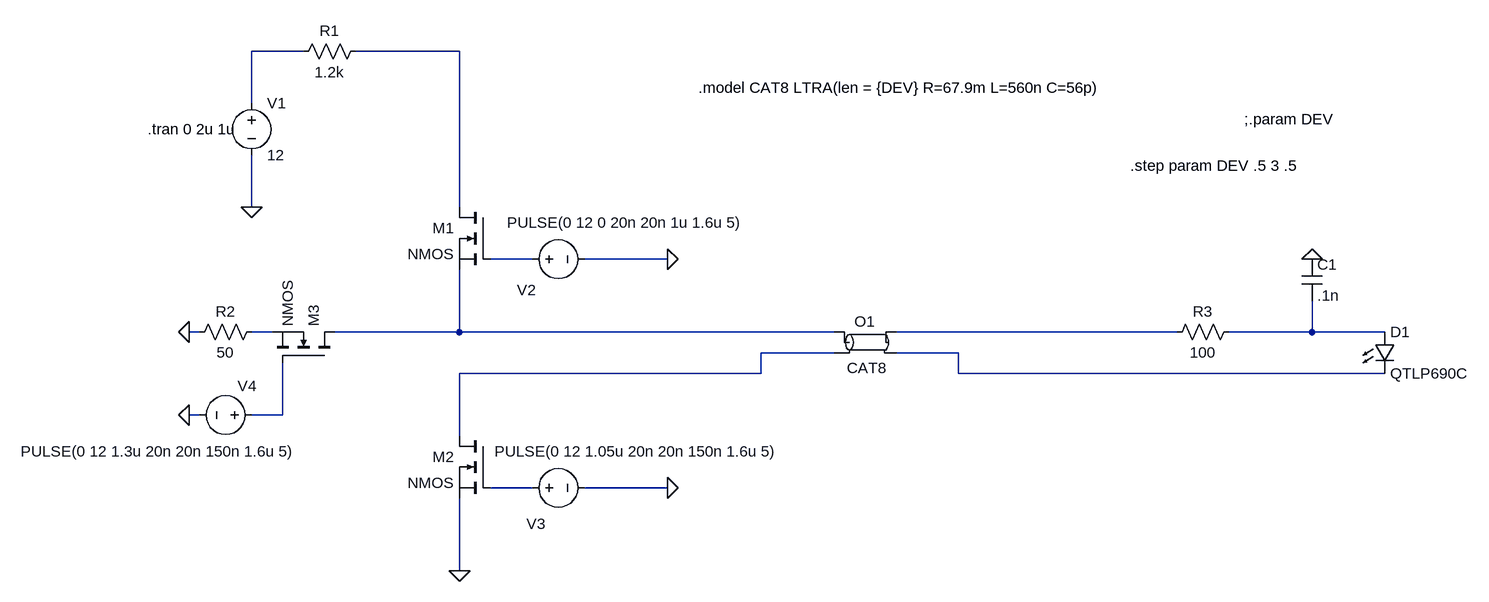
[diagram p0: schematic LEDpulser4_CAT8_NEW.asc]
LEDpulser4_CAT8_NEW.asc, the LTspice schematic file:
Version 4
SHEET 1 1400 680
WIRE -592 -336 -672 -336
WIRE -352 -336 -512 -336
WIRE -672 -256 -672 -336
WIRE -672 -96 -672 -176
WIRE -352 -96 -352 -336
WIRE -240 -16 -304 -16
WIRE -32 -16 -160 -16
WIRE -752 96 -768 96
WIRE -640 96 -672 96
WIRE -352 96 -352 0
WIRE -352 96 -544 96
WIRE 224 96 -352 96
WIRE 752 96 320 96
WIRE 960 96 960 48
WIRE 960 96 832 96
WIRE 1072 96 960 96
WIRE 224 128 112 128
WIRE 416 128 320 128
WIRE 112 160 112 128
WIRE 112 160 -352 160
WIRE 416 160 416 128
WIRE 1072 160 416 160
WIRE -752 224 -768 224
WIRE -624 224 -624 144
WIRE -624 224 -672 224
WIRE -352 256 -352 160
WIRE -240 336 -304 336
WIRE -32 336 -160 336
WIRE -352 464 -352 352
FLAG -32 -16 0
FLAG -672 -96 0
FLAG -32 336 0
FLAG -768 224 0
FLAG -768 96 0
FLAG 960 -16 0
FLAG -352 464 0
SYMBOL voltage -672 -272 R0
WINDOW 123 0 0 Left 0
WINDOW 39 0 0 Left 0
SYMATTR InstName V1
SYMATTR Value 12
SYMBOL voltage -256 -16 R270
WINDOW 0 -63 7 VTop 2
WINDOW 3 72 159 VBottom 2
WINDOW 123 0 0 Left 0
WINDOW 39 0 0 Left 0
SYMATTR InstName V2
SYMATTR Value PULSE(0 12 0 20n 20n 1u 1.6u 5)
SYMBOL nmos -304 -96 M0
SYMATTR InstName M1
SYMBOL res -496 -352 R90
WINDOW 0 0 56 VBottom 2
WINDOW 3 32 56 VTop 2
SYMATTR InstName R1
SYMATTR Value 1.2k
SYMBOL nmos -304 256 M0
SYMATTR InstName M2
SYMBOL voltage -256 336 R270
WINDOW 0 -55 7 VRight 2
WINDOW 3 56 -42 VRight 2
WINDOW 123 0 0 Left 0
WINDOW 39 0 0 Left 0
SYMATTR InstName V3
SYMATTR Value PULSE(0 12 1.05u 20n 20n 150n 1.6u 5)
SYMBOL nmos -544 144 M270
SYMATTR InstName M3
SYMBOL res -768 112 R270
WINDOW 0 32 56 VTop 2
WINDOW 3 0 56 VBottom 2
SYMATTR InstName R2
SYMATTR Value 50
SYMBOL voltage -656 224 R90
WINDOW 0 -45 8 VRight 2
WINDOW 3 56 -54 VRight 2
WINDOW 123 0 0 Left 0
WINDOW 39 0 0 Left 0
SYMATTR InstName V4
SYMATTR Value PULSE(0 12 1.3u 20n 20n 150n 1.6u 5)
SYMBOL LED 1056 96 R0
SYMATTR InstName D1
SYMATTR Value QTLP690C
SYMBOL cap 944 -16 R0
SYMATTR InstName C1
SYMATTR Value .1n
SYMBOL res 848 80 R90
WINDOW 0 0 56 VBottom 2
WINDOW 3 32 56 VTop 2
SYMATTR InstName R3
SYMATTR Value 100
SYMBOL ltline 272 112 R0
WINDOW 3 3 24 Top 2
SYMATTR Value CAT8
SYMATTR InstName O1
TEXT -832 -216 Left 2 !.tran 0 2u 1u
TEXT 16 -280 Left 2 !.model CAT8 LTRA(len = {DEV} R=67.9m L=560n C=56p)
TEXT 680 -160 Left 2 !.step param DEV .5 3 .5
TEXT 856 -232 Left 2 !;.param DEV

The netlist it stands for:
* LEDpulser4_CAT8_NEW.asc
V1 N001 0 12
V2 N003 0 PULSE(0 12 0 20n 20n 1u 1.6u 5)
M1 N002 N003 N005 N005 NMOS
R1 N002 N001 1.2k
M2 N008 N011 0 0 NMOS
V3 N011 0 PULSE(0 12 1.05u 20n 20n 150n 1.6u 5)
M3 N005 N010 N004 N004 NMOS
R2 0 N004 50
V4 N010 0 PULSE(0 12 1.3u 20n 20n 150n 1.6u 5)
D1 N007 N009 QTLP690C
C1 0 N007 .1n
R3 N007 N006 100
O1 N005 N008 N006 N009 CAT8
.model D D
.lib standard.dio
.model NMOS NMOS
.model PMOS PMOS
.lib standard.mos
.tran 0 2u 1u
.model CAT8 LTRA(len = {DEV} R=67.9m L=560n C=56p)
.step param DEV .5 3 .5
;.param DEV
.backanno
.end